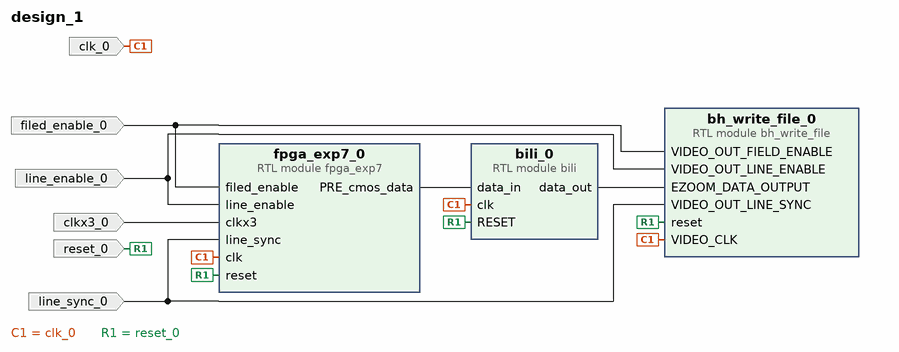
[diagram p0: block diagram of the top level]
# Vivado block design design_1, xc7a100tcsg324-1, Vivado 2019.2
create_bd_design design_1

create_bd_port -dir I -type clk clk_0
create_bd_port -dir I filed_enable_0
create_bd_port -dir I line_enable_0
create_bd_port -dir I line_sync_0
create_bd_port -dir I -type rst reset_0
create_bd_port -dir I clkx3_0

create_bd_cell -type module -reference fpga_exp7 fpga_exp7_0
create_bd_cell -type module -reference bh_write_file bh_write_file_0
create_bd_cell -type module -reference bili bili_0

# ---- connections ----

connect_bd_net -net clk_0_1 [get_bd_ports clk_0] [get_bd_pins fpga_exp7_0/clk] [get_bd_pins bh_write_file_0/VIDEO_CLK] [get_bd_pins bili_0/clk]
connect_bd_net -net filed_enable_0_1 [get_bd_ports filed_enable_0] \
  [get_bd_pins fpga_exp7_0/filed_enable] [get_bd_pins bh_write_file_0/VIDEO_OUT_FIELD_ENABLE]
connect_bd_net -net line_enable_0_1 [get_bd_ports line_enable_0] \
  [get_bd_pins fpga_exp7_0/line_enable] [get_bd_pins bh_write_file_0/VIDEO_OUT_LINE_ENABLE]
connect_bd_net -net line_sync_0_1 [get_bd_ports line_sync_0] [get_bd_pins fpga_exp7_0/line_sync] [get_bd_pins bh_write_file_0/VIDEO_OUT_LINE_SYNC]
connect_bd_net -net reset_0_1 [get_bd_ports reset_0] [get_bd_pins fpga_exp7_0/reset] [get_bd_pins bh_write_file_0/reset] [get_bd_pins bili_0/RESET]
connect_bd_net -net clkx3_0_1 [get_bd_ports clkx3_0] [get_bd_pins fpga_exp7_0/clkx3]
connect_bd_net [get_bd_pins fpga_exp7_0/PRE_cmos_data] [get_bd_pins bili_0/data_in]
connect_bd_net [get_bd_pins bili_0/data_out] [get_bd_pins bh_write_file_0/EZOOM_DATA_OUTPUT]

validate_bd_design
save_bd_design
